# Altium schematic sheet Pcb.SchDoc
size A
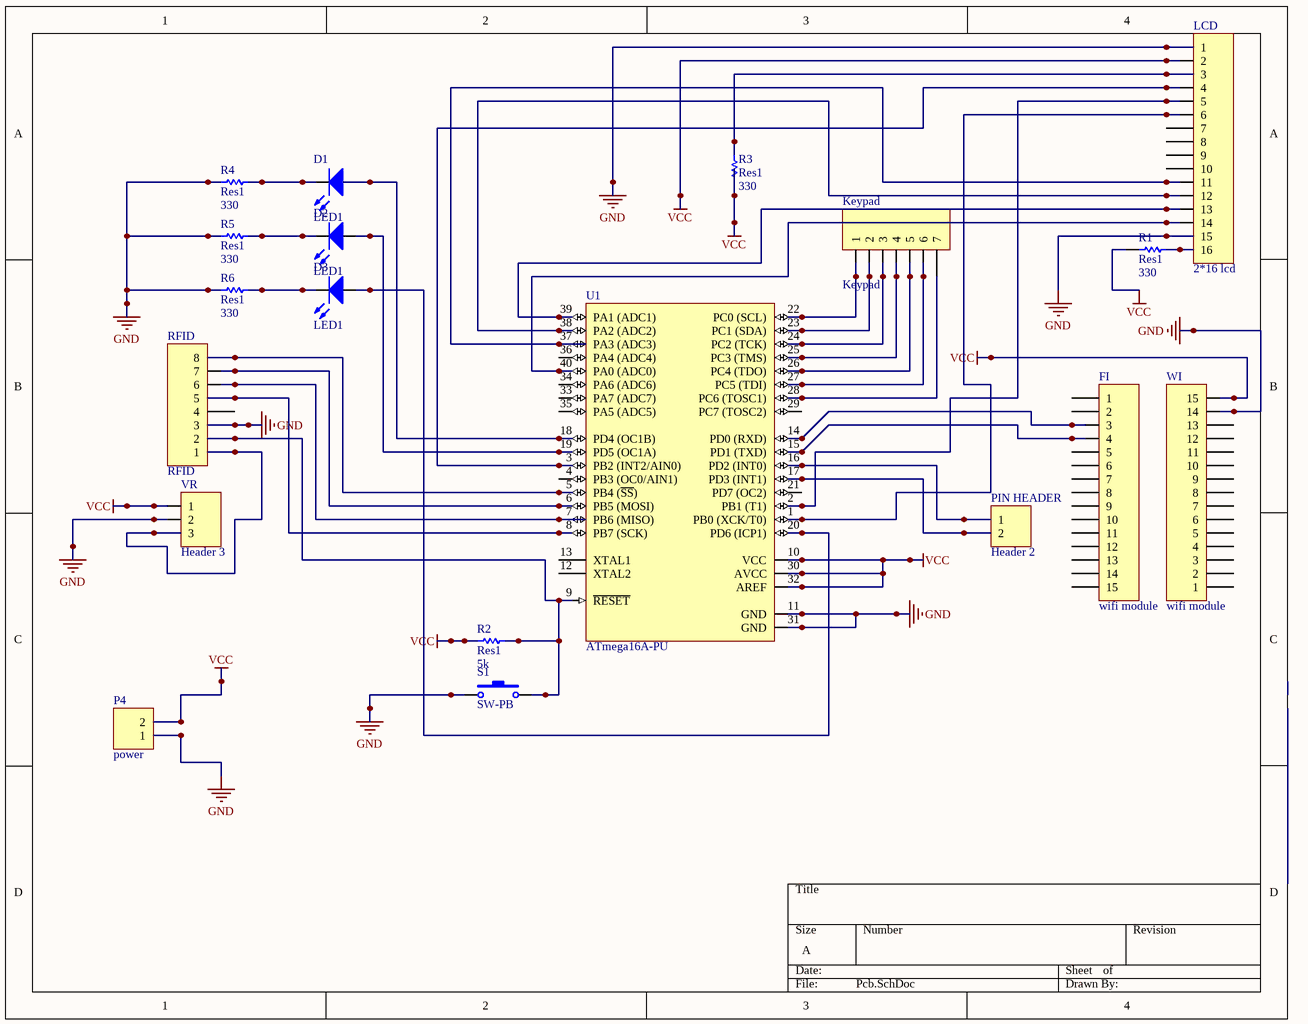
[diagram p0: Pcb.SchDoc]

## Parts
D1  LED1  [LED-1]
D2  LED1  [LED-1]
D3  LED1  [LED-1]
FI  wifi module  [HDR1X15]
Keypad  Keypad  [HDR1X7]
LCD  2*16 lcd  [HDR1X16]
P4  power  [HDR1X2]
PIN_HEADER  Header 2  [HDR1X2]
R1  Res1  value 330  [AXIAL-0.3]
R2  Res1  value 5k  [AXIAL-0.3]
R3  Res1  value 330  [AXIAL-0.3]
R4  Res1  value 330  [AXIAL-0.3]
R5  Res1  value 330  [AXIAL-0.3]
R6  Res1  value 330  [AXIAL-0.3]
RFID  RFID  [HDR1X8]
S1  SW-PB  [SPST-2]
U1  ATmega16A-PU  [40P6]
VR  Header 3  [HDR1X3]
WI  wifi module  [HDR1X15]

## Nets
GND: LCD.1 LCD.15 P4.1 R4.1 R5.1 R6.1 RFID.3 S1.1 U1.11(GND) U1.31(GND) VR.2 WI.14
VCC: LCD.2 P4.2 R1.1 R2.2 R3.1 U1.10(VCC) U1.30(AVCC) U1.32(AREF) VR.1 WI.15
NetD1_1: D1.1(A) U1.18(PD4_(OC1B))
NetD1_2: D1.2(K) R4.2
NetD2_1: D2.1(A) U1.19(PD5_(OC1A))
NetD2_2: D2.2(K) R5.2
NetD3_1: D3.1(A) U1.20(PD6_(ICP1))
NetD3_2: D3.2(K) R6.2
NetFI_3: FI.3 U1.14(PD0_(RXD))
NetFI_4: FI.4 U1.15(PD1_(TXD))
NetKeypad_1: Keypad.1 U1.22(PC0_(SCL))
NetKeypad_2: Keypad.2 U1.23(PC1_(SDA))
NetKeypad_3: Keypad.3 U1.24(PC2_(TCK))
NetKeypad_4: Keypad.4 U1.25(PC3_(TMS))
NetKeypad_5: Keypad.5 U1.26(PC4_(TDO))
NetKeypad_6: Keypad.6 U1.27(PC5_(TDI))
NetKeypad_7: Keypad.7 U1.28(PC6_(TOSC1))
NetLCD_3: LCD.3 R3.2
NetLCD_4: LCD.4 U1.3(PB2_(INT2/AIN0))
NetLCD_5: LCD.5 U1.2(PB1_(T1))
NetLCD_6: LCD.6 U1.1(PB0_(XCK/T0))
NetLCD_11: LCD.11 U1.37(PA3_(ADC3))
NetLCD_12: LCD.12 U1.38(PA2_(ADC2))
NetLCD_13: LCD.13 U1.39(PA1_(ADC1))
NetLCD_14: LCD.14 U1.40(PA0_(ADC0))
NetLCD_16: LCD.16 R1.2
NetPIN_HEADER_1: PIN_HEADER.1 U1.16(PD2_(INT0))
NetPIN_HEADER_2: PIN_HEADER.2 U1.17(PD3_(INT1))
NetR2_1: R2.1 RFID.2 S1.2 U1.9(~{RESET})
NetRFID_1: RFID.1 VR.3
NetRFID_5: RFID.5 U1.8(PB7_(SCK))
NetRFID_6: RFID.6 U1.7(PB6_(MISO))
NetRFID_7: RFID.7 U1.6(PB5_(MOSI))
NetRFID_8: RFID.8 U1.5(PB4_(~{SS}))

Not connected (* = marked no-connect by the designer): FI 1 2 5 6 7 8 9 10 11 12 13 14 15; LCD 7 8 9 10; RFID 4; U1 4(PB3_(OC0/AIN1)) 12(XTAL2) 13(XTAL1) 21(PD7_(OC2)) 29(PC7_(TOSC2)) 33(PA7_(ADC7)) 34(PA6_(ADC6)) 35(PA5_(ADC5)) 36(PA4_(ADC4)); WI 1 2 3 4 5 6 7 8 9 10 11 12 13

## Library data of the parts
D1-D3 = LED1: Typical RED GaAs LED; Published: 8-Jun-2000; LatestRevisionDate: 08-Jul-2005; LatestRevisionNote: Mech Layer 1 removed.; PackageReference: LED-1; Publisher: Altium Limited; PackageDescription: LED; 2 Leads
FI WI = Header 15: Header, 15-Pin; LatestRevisionDate: 17-Jul-2002; LatestRevisionNote: Re-released for DXP Platform.; Publisher: Altium Limited
Keypad = Header 7: Header, 7-Pin; LatestRevisionDate: 17-Jul-2002; LatestRevisionNote: Re-released for DXP Platform.; Publisher: Altium Limited
LCD = Header 16: Header, 16-Pin; LatestRevisionDate: 17-Jul-2002; LatestRevisionNote: Re-released for DXP Platform.; Publisher: Altium Limited
P4 PIN_HEADER = Header 2: Header, 2-Pin; LatestRevisionDate: 17-Jul-2002; LatestRevisionNote: Re-released for DXP Platform.; Publisher: Altium Limited
R1-R6 = Res1: Resistor; Published: 8-Jun-2000; LatestRevisionDate: 17-Jul-2002; LatestRevisionNote: Re-released for DXP Platform.; PackageReference: AXIAL-0.3; Publisher: Altium Limited; PackageDescription: Axial Device, Thru-Hole; 2 Leads; 0.3 in Pin Spacing
RFID = Header 8: Header, 8-Pin; LatestRevisionDate: 17-Jul-2002; LatestRevisionNote: Re-released for DXP Platform.; Publisher: Altium Limited
S1 = SW-PB: Switch; Published: 24-Mar-1999; LatestRevisionDate: 17-Jul-2002; LatestRevisionNote: Re-released for DXP Platform.; PackageReference: SPST-2; Publisher: Altium Limited; PackageDescription: Switch; 2 Leads
U1 = ATmega16A-PU: 8-bit AVR Microcontroller, 16KB Flash, 512 Bytes EEPROM, 1KB SRAM, 40-pin PDIP, Industrial Grade (-40°C to 85°C); Published: 1-Apr-2010; DatasheetVersion: revB, Jul-2009; PackageVersion: revB, Sep-2001; PackageReference: 40P6; Publisher: Altium Limited; PackageDescription: 40-lead (0.600"/15.24mm Wide) Plastic Dual Inline Package (PDIP); Supplier 1: Digi-Key; Supplier Part Number 1: ATMEGA16A-PU-ND; Supplier 2: Farnell; Supplier Part Number 2: 1704561; Supplier 3: Mouser; Supplier Part Number 3: 556-ATMEGA16A-PU; Code_JEDEC: MS-011-AC; ComponentLink1Description: Manufacturer Link; ComponentLink1URL: http://www.atmel.com/products/avr/default.asp?; ComponentLink2Description: ATmega16A Datasheet; ComponentLink2URL: http://www.atmel.com/dyn/resources/prod_documents/doc8154.pdf; ComponentLink3Description: ATmega16A Summary; ComponentLink3URL: http://www.atmel.com/dyn/resources/prod_documents/8154S.pdf; ComponentLink4Description: Atmel.com Home; ComponentLink4URL: http://www.atmel.com
VR = Header 3: Header, 3-Pin; LatestRevisionDate: 17-Jul-2002; LatestRevisionNote: Re-released for DXP Platform.; Publisher: Altium Limited